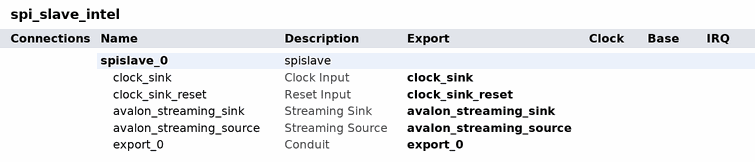
[diagram p0: system contents]
# Platform Designer (Qsys) system spi_slave_intel, Cyclone IV GX EP4CGX150DF27I7
# Parameters at their usual value, and those the tool derives, are not listed.
package require qsys
create_system spi_slave_intel
set_project_property DEVICE_FAMILY {Cyclone IV GX}
set_project_property DEVICE EP4CGX150DF27I7

add_instance spislave_0 spislave 22.1
set_instance_property spislave_0 AUTO_EXPORT true
set_instance_parameter_value spislave_0 SYNC_DEPTH 2

# exported interfaces
add_interface avalon_streaming_sink avalon_streaming sink
set_interface_property avalon_streaming_sink EXPORT_OF spislave_0.avalon_streaming_sink
add_interface avalon_streaming_source avalon_streaming source
set_interface_property avalon_streaming_source EXPORT_OF spislave_0.avalon_streaming_source
add_interface clock_sink clock sink
set_interface_property clock_sink EXPORT_OF spislave_0.clock_sink
add_interface clock_sink_reset reset sink
set_interface_property clock_sink_reset EXPORT_OF spislave_0.clock_sink_reset
add_interface export_0 conduit end
set_interface_property export_0 EXPORT_OF spislave_0.export_0

set_interconnect_requirement {$system} qsys_mm.clockCrossingAdapter HANDSHAKE
set_interconnect_requirement {$system} qsys_mm.enableEccProtection FALSE
set_interconnect_requirement {$system} qsys_mm.insertDefaultSlave FALSE
set_interconnect_requirement {$system} qsys_mm.maxAdditionalLatency 1

save_system spi_slave_intel.qsys
